# Altium schematic sheet MCU.SchDoc
size A
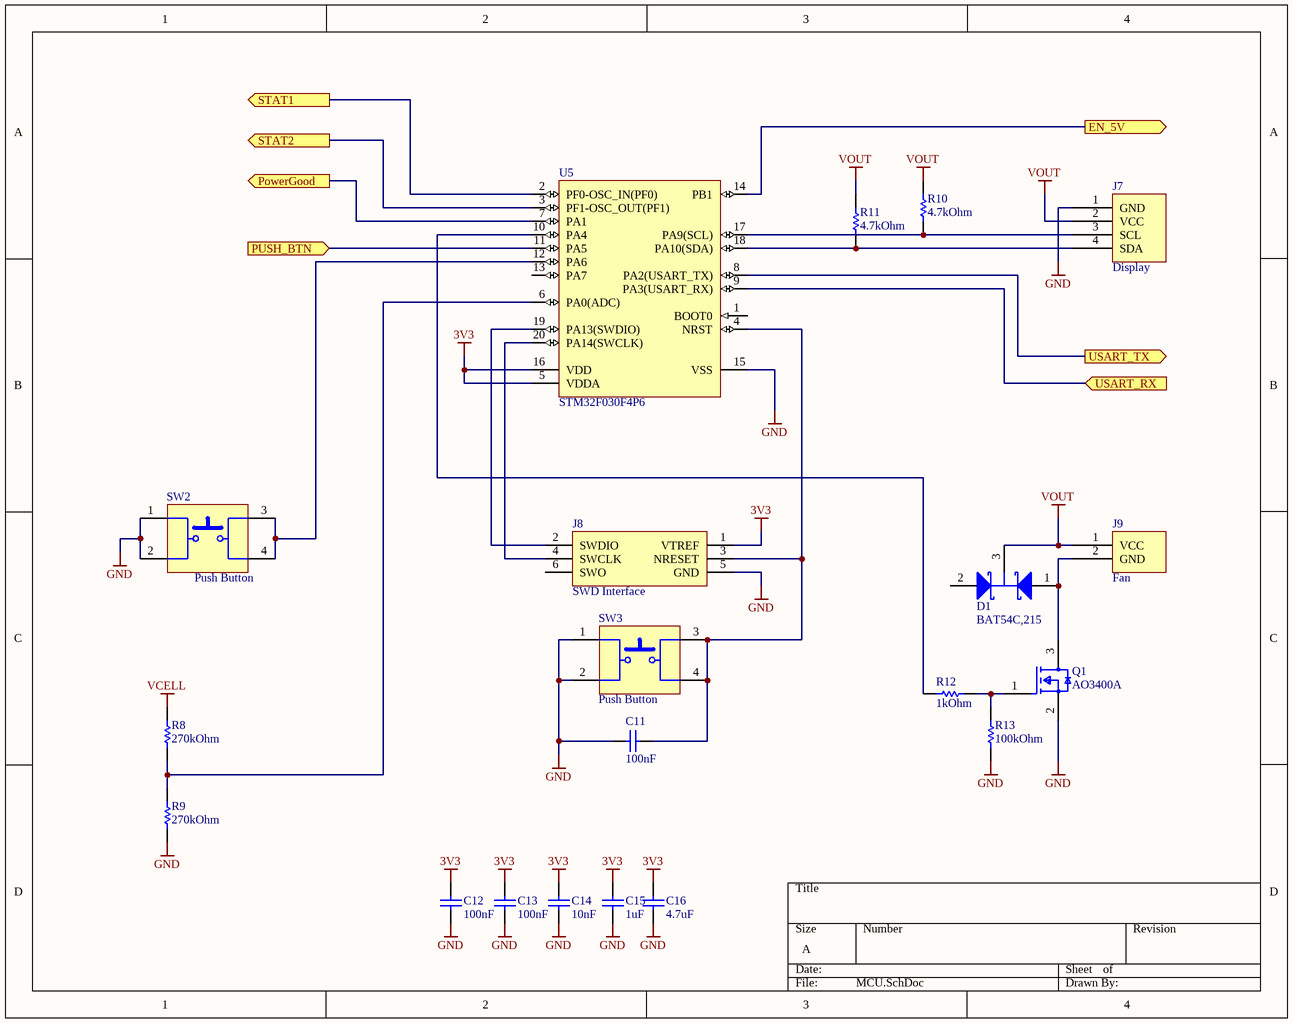
[diagram p0: MCU.SchDoc]

## Parts
C11  100nF  [CAP_0804]
C12  100nF  [CAP_0804]
C13  100nF  [CAP_0804]
C14  10nF  [CAP_0804]
C15  1uF  [CAP_0804]
C16  4.7uF  [CAP_0804]
D1  BAT54C,215  [SOT23]
J7  Display  [OLED_DISPLAY]
J8  SWD Interface  [J-Link_6-pin_Needle_Adapter]  (no BOM)
J9  Fan  [FAN_CONNECTOR]
Q1  AO3400A  [SOT23]
R8  270kOhm  [RES_0804]
R9  270kOhm  [RES_0804]
R10  4.7kOhm  [RES_0804]
R11  4.7kOhm  [RES_0804]
R12  1kOhm  [RES_0804]
R13  100kOhm  [RES_0804]
SW2  Push Button  [SWITCH]
SW3  Push Button  [SWITCH]
U5  STM32F030F4P6  [STM32F030]

## Ports
EN_5V (out), PowerGood (out), PUSH_BTN (in), STAT1 (out), STAT2 (out), USART_RX (in), USART_TX (out)

## Nets
3V3: C12.2 C13.2 C14.2 C15.2 C16.2 J8.1(VTREF) U5.5(VDDA) U5.16(VDD)
GND: C11.1 C12.1 C13.1 C14.1 C15.1 C16.1 J7.1(GND) J8.5(GND) Q1.2(S) R9.1 R13.1 SW2.1 SW2.2 SW3.1 SW3.2 U5.15(VSS)
VCELL: R8.2
VOUT: D1.3(K) J7.2(VCC) J9.1(VCC) R10.2 R11.2
EN_5V: U5.14(PB1) ; port EN_5V
PowerGood: U5.7(PA1) ; port PowerGood
PUSH_BTN: U5.11(PA5) ; port PUSH_BTN
STAT1: U5.2(PF0-OSC_IN(PF0)) ; port STAT1
STAT2: U5.3(PF1-OSC_OUT(PF1)) ; port STAT2
USART_RX: U5.9(PA3(USART_RX)) ; port USART_RX
USART_TX: U5.8(PA2(USART_TX)) ; port USART_TX
NetC11_2: C11.2 J8.3(NRESET) SW3.3 SW3.4 U5.4(NRST)
NetD1_1: D1.1(A) J9.2(GND) Q1.3(D)
NetJ7_3: J7.3(SCL) R10.1 U5.17(PA9(SCL))
NetJ7_4: J7.4(SDA) R11.1 U5.18(PA10(SDA))
NetJ8_2: J8.2(SWDIO) U5.19(PA13(SWDIO))
NetJ8_4: J8.4(SWCLK) U5.20(PA14(SWCLK))
NetQ1_1: Q1.1(G) R12.2 R13.2
NetR8_1: R8.1 R9.2 U5.6(PA0(ADC))
NetR12_1: R12.1 U5.10(PA4)
NetSW2_3: SW2.3 SW2.4 U5.12(PA6)

Not connected (* = marked no-connect by the designer): D1 2(A); J8 6(SWO); U5 1(BOOT0) 13(PA7)

## Library data of the parts
C11-C13 = CAP_100NF: PartNumber: 1206GC102KAT1A; Manufacturer: AVX; Capacitance: 0.001uF; Dielectric: X7R; Tolerance: 10%; Tolerance (%): ±10%; Voltage Rating DC: 2000V; Package Reference: 1206; Datasheet Version: 11/2010; Mounting Technology: SurfaceMount; Manufacturer URL: http://www.avx.com/; Datasheet URL: https://datasheet.ciiva.com/11787/0900766b80ed4c37-11787781.pdf; Package Description: 2-Pin SMD, Body 3.4 x 1.8 mm; Case Size/Dimension: 1206; Rated Voltage: 2000V
C14 = CAP_10NF: PartNumber: 1206GC102KAT1A; Manufacturer: AVX; Capacitance: 0.001uF; Dielectric: X7R; Tolerance: 10%; Tolerance (%): ±10%; Voltage Rating DC: 2000V; Package Reference: 1206; Datasheet Version: 11/2010; Mounting Technology: SurfaceMount; Manufacturer URL: http://www.avx.com/; Datasheet URL: https://datasheet.ciiva.com/11787/0900766b80ed4c37-11787781.pdf; Package Description: 2-Pin SMD, Body 3.4 x 1.8 mm; Case Size/Dimension: 1206; Rated Voltage: 2000V
C15 = CAP_1UF: PartNumber: 1206GC102KAT1A; Manufacturer: AVX; Capacitance: 0.001uF; Dielectric: X7R; Tolerance: 10%; Tolerance (%): ±10%; Voltage Rating DC: 2000V; Package Reference: 1206; Datasheet Version: 11/2010; Mounting Technology: SurfaceMount; Manufacturer URL: http://www.avx.com/; Datasheet URL: https://datasheet.ciiva.com/11787/0900766b80ed4c37-11787781.pdf; Package Description: 2-Pin SMD, Body 3.4 x 1.8 mm; Case Size/Dimension: 1206; Rated Voltage: 2000V
C16 = CAP_4.7UF: PartNumber: 1206GC102KAT1A; Manufacturer: AVX; Capacitance: 0.001uF; Dielectric: X7R; Tolerance: 10%; Tolerance (%): ±10%; Voltage Rating DC: 2000V; Package Reference: 1206; Datasheet Version: 11/2010; Mounting Technology: SurfaceMount; Manufacturer URL: http://www.avx.com/; Datasheet URL: https://datasheet.ciiva.com/11787/0900766b80ed4c37-11787781.pdf; Package Description: 2-Pin SMD, Body 3.4 x 1.8 mm; Case Size/Dimension: 1206; Rated Voltage: 2000V
D1 = DIODE_BAT54C: Schottky Barrier Diode, 30 V, 3-Pin SOT23, RoHS, Tape and Reel; Manufacturer: NXP Semiconductors; Forward Surge Current Ifsm Max: 600mA; Pin Configuration: 1A1,2A2,3comK; Package Version: Feb-16; Forward Voltage VF Max: 800mV; SMD Marking: L43/*W1; Diode Case Style: SOT-23; Reverse Recovery Time trr Typ: 5ns; Forward Current If(AV): 200mA; Reel Quantity: 3000; SVHC: NoSVHC(19-Dec-2012); No. of Pins: 3; Junction Temperature Tj Max: 125degC; Common Connection: Cathode; Repetitive Reverse Voltage Vrrm Max: 30V; Operating Temperature Max: 150degC; Operating Temperature Range: -65degCto+150degC; Termination Type: SMD; Package Description: 3-Pin Small Outline Transistor, Body 1.3 x 2.9 mm, Pitch 0.95 mm; Package / Case: SOT-23; Diode Type: Schottky; Manufacturer URL: http://www.nxp.com/; Tape Width: 8mm; Package Reference: SOT23-3; Datasheet URL: https://datasheet.ciiva.com/33723/1668625-33723936.pdf; Datasheet Version: Rev. 5 , 10/2012; Operating Temperature Min: -65degC; Current Ifsm: 600mA; Reverse Recovery Time trr Max: 5ns; Package URL: http://www.nxp.com/documents/outline_drawing/SOT23.pdf; Forward Voltage: 800mV
J7 = Oled Display: Tiger Claw(TM) Socket Strip, Through-hole, Vertical, -55 to 105 degC, 2 mm Pitch, 4-Pin, Female, RoHS; Manufacturer: Samtec; PartNumber: MMS-104-01-T-SV; Pitch: 2 mm; PackageDescription: 2mm Through Hole Box Connector Strip Assembly; DatasheetVersion: F-214; ComponentLink1URL: http://www.samtec.com; RoHS: True; Temperature Range: -55 to 105 degC; ComponentLink1Description: Manufacturer URL; Mounting Technology: Through-hole; ComponentLink2Description: Datasheet; Orientation: Vertical; ComponentLink2URL: http://www.samtec.com/documents/webfiles/pdf/MMS.PDF; ComponentLink3Description: Package Specification; ComponentLink3URL: http://www.samtec.com/documents/webfiles/cpdf/MMS-1XX-01-XXX-XX-XXX-MKT1.pdf; PackageVersion: AO, 2/1993; PackageReference: MMS-104-01-X-SV
J8 = J-Link_6-pin_Needle_Adapter: J-Link 6-pin Needle Adapter
J9 = FAN: Tiger Claw(TM) Socket Strip, Through-hole, Vertical, -55 to 105 degC, 2 mm Pitch, 4-Pin, Female, RoHS; Manufacturer: Samtec; PartNumber: MMS-104-01-T-SV; Pitch: 2 mm; PackageDescription: 2mm Through Hole Box Connector Strip Assembly; DatasheetVersion: F-214; ComponentLink1URL: http://www.samtec.com; RoHS: True; Temperature Range: -55 to 105 degC; ComponentLink1Description: Manufacturer URL; Mounting Technology: Through-hole; ComponentLink2Description: Datasheet; Orientation: Vertical; ComponentLink2URL: http://www.samtec.com/documents/webfiles/pdf/MMS.PDF; ComponentLink3Description: Package Specification; ComponentLink3URL: http://www.samtec.com/documents/webfiles/cpdf/MMS-1XX-01-XXX-XX-XXX-MKT1.pdf; PackageVersion: AO, 2/1993; PackageReference: MMS-104-01-X-SV
Q1 = MOSFET_AO3400A: MOSFET N-CH 30V 5.7A SOT23; Input Capacitance: 630pF; Number of Elements: 1; Rds On Max: 26.5mR; Max Power Dissipation: 1.4W; Gate to Source Voltage (Vgs): 12V; Min Operating Temperature: -55°C; Lead Free: Lead Free; Number of Pins: 3; Drain to Source Voltage (Vdss): 30V; Case/Package: SOT-23; Mount: Surface Mount; Continuous Drain Current (ID): 5.7A; Radiation Hardening: No; Packaging: Tape and Reel; Max Operating Temperature: 150°C; Power Dissipation: 1.4W
R8 R9 = RES_270K: Part Number: CRCW120647K0FKEA; Manufacturer: Vishay Dale
R10 R11 = RES_4.7K: Part Number: CRCW120647K0FKEA; Manufacturer: Vishay Dale
R12 = RES_1K: Part Number: CRCW120647K0FKEA; Manufacturer: Vishay Dale
R13 = RES_100K: Part Number: CRCW120647K0FKEA; Manufacturer: Vishay Dale
SW2 SW3 = SWITCH: Micro Miniature Push Button Switch FSM JSM, 50 mA, -35 to 85 degC, 4-Pin SMD, RoHS, Tape and Reel; Manufacturer: TE Connectivity; Mechanical Life: 100000Cycles; Current Rating: 50mA; Actuator Material: Polyamide; Max Voltage Rating (DC): 12V; Capacitance: 0f; Illumination Type: Illuminated; Voltage Rating (DC): 24V; Case\/Package: SMD/SMT; Operating Force: 160gf; Contact Resistance: 100mOhm; Actuator Length: 0.055inch; Switch Travel: 0.25mm; Throw Configuration: SPST; Termination: GullWing; Contact Plating: Silver; Orientation: Straight; Mounting Technology: SurfaceMount; REACH SVHC: Unknown; Electrical Life: 100000Cycles; Package Reference: FSM4JSMATR; Max Operating Temperature: 85degC; Manufacturer URL: http://www.te.com/; Package Description: 4-Pin Surface Mount Device, Body 6 x 6 mm, Pitch 4.5 mm; Datasheet Version: Rev. V, 02/2015; Packaging: TapeandReel; Min Operating Temperature: -35degC; Mount: SurfaceMount; Contact Current Rating: 50mA; Contact Material: CopperAlloy; Package Quantity: 1200; Datasheet URL: http://www.te.com/commerce/DocumentDelivery/DDEController?Action=showdoc&DocId=Customer+Drawing%7F2-1437565-7%7FV%7Fpdf%7FEnglish%7FENG_CD_2-1437565-7_V.pdf%7F4-1437565-2; RoHSCompliant: true
U5 = STM32F030: ARM Cortex-M0 32-bit MCU, 16 KB Flash, 4 KB Internal RAM, 15 I/Os, 20-pin TSSOP, -40 to 85 degC, Tube; I/Os (High Current): 15; FLASH Size (Prog) (kB): 16; Internal RAM Size (kB): 4; Supply Voltage(Vcc) min (V): 2.4; Operating Frequency(F) (Processor speed) (MHz): 48; ComponentLink2URL: http://www.st.com/st-web-ui/static/active/en/resource/technical/document/datasheet/DM00088500.pdf; Core: ARM Cortex-M0; ComponentLink2Description: Datasheet; PackageDescription: 20-Pin Thin Shrink Small Outline Package, 6.5 x 4.4 mm Body, 0.65 mm Pitch; Mounting Technology: Surface Mount; ComponentLink1URL: http://www.st.com/web/en/home.html; PackageVersion: Rev. 1, 11/2012; ComponentLink3Description: Package Specification; PartNumber: STM32F030F4P6; ComponentLink3URL: http://www.st.com/st-web-ui/static/active/en/resource/technical/document/datasheet/DM00065136.pdf; DatasheetVersion: Rev. 1; PackageReference: TSSOP20; ComponentLink1Description: Manufacturer URL; Packing: Tube